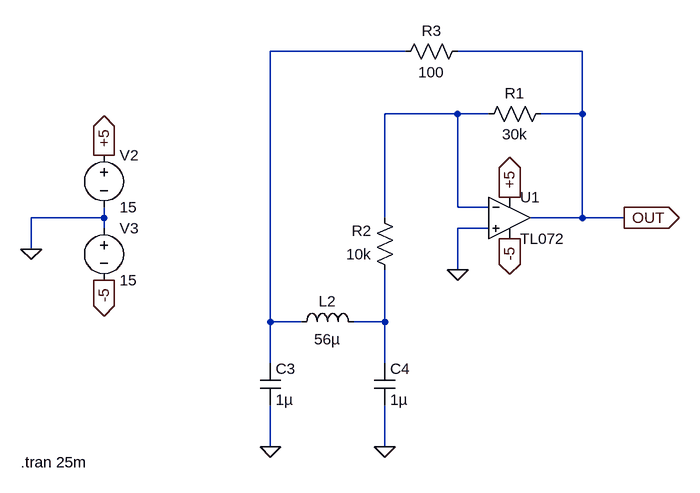
[diagram p0: schematic Colpitts.asc]
Colpitts.asc, the LTspice schematic file:
Version 4
SHEET 1 2120 680
WIRE 1024 -224 816 -224
WIRE 1296 -224 1104 -224
WIRE 1104 -128 992 -128
WIRE 1152 -128 1104 -128
WIRE 1296 -128 1296 -224
WIRE 1296 -128 1232 -128
WIRE 1104 16 1104 -128
WIRE 1152 16 1104 16
WIRE 560 32 560 16
WIRE 560 32 448 32
WIRE 992 32 992 -128
WIRE 1296 32 1296 -128
WIRE 1296 32 1216 32
WIRE 1360 32 1296 32
WIRE 560 48 560 32
WIRE 1152 48 1104 48
WIRE 448 80 448 32
WIRE 1104 112 1104 48
WIRE 816 192 816 -224
WIRE 864 192 816 192
WIRE 992 192 992 112
WIRE 992 192 944 192
WIRE 816 256 816 192
WIRE 992 256 992 192
WIRE 816 384 816 320
WIRE 992 384 992 320
FLAG 816 384 0
FLAG 992 384 0
FLAG 448 80 0
FLAG 560 -64 +5
IOPIN 560 -64 Out
FLAG 560 128 -5
IOPIN 560 128 Out
FLAG 1184 64 -5
IOPIN 1184 64 Out
FLAG 1184 0 +5
IOPIN 1184 0 Out
FLAG 1104 112 0
FLAG 1360 32 OUT
IOPIN 1360 32 Out
SYMBOL ind 848 208 R270
WINDOW 0 32 56 VTop 2
WINDOW 3 5 56 VBottom 2
SYMATTR InstName L2
SYMATTR Value 56µ
SYMATTR SpiceLine Cpar=0
SYMBOL cap 800 256 R0
SYMATTR InstName C3
SYMATTR Value 1µ
SYMATTR SpiceLine Irms=0 Rser=0 Lser=0
SYMBOL cap 976 256 R0
SYMATTR InstName C4
SYMATTR Value 1µ
SYMATTR SpiceLine Lser=0
SYMBOL voltage 560 -80 R0
WINDOW 123 0 0 Left 0
WINDOW 39 0 0 Left 0
SYMATTR InstName V2
SYMATTR Value 15
SYMBOL voltage 560 32 R0
WINDOW 123 0 0 Left 0
WINDOW 39 0 0 Left 0
SYMATTR InstName V3
SYMATTR Value 15
SYMBOL res 1248 -144 R90
WINDOW 0 0 56 VBottom 2
WINDOW 3 32 56 VTop 2
SYMATTR InstName R1
SYMATTR Value 30k
SYMBOL res 1008 128 R180
WINDOW 0 36 76 Left 2
WINDOW 3 36 40 Left 2
SYMATTR InstName R2
SYMATTR Value 10k
SYMBOL res 1120 -240 R90
WINDOW 0 0 56 VBottom 2
WINDOW 3 32 56 VTop 2
SYMATTR InstName R3
SYMATTR Value 100
SYMBOL AutoGenerated\\TL072 1184 32 R0
SYMATTR InstName U1
TEXT 432 408 Left 2 !.tran 25m

The netlist it stands for:
* Colpitts.asc
L2 N001 N003 56µ Cpar=0
C3 N001 0 1µ Irms=0 Rser=0 Lser=0
C4 N003 0 1µ Lser=0
V2 +5 0 15
V3 0 -5 15
R1 OUT N002 30k
R2 N003 N002 10k
R3 OUT N001 100
* U1: TL072 (symbol AutoGenerated\TL072 not available, pins judged from their places): In+=0 In-=N002 V+=+5 V-=-5 OUT=OUT
.tran 25m
.backanno
.end